# Altium schematic sheet Power_Sources.SchDoc
size A4
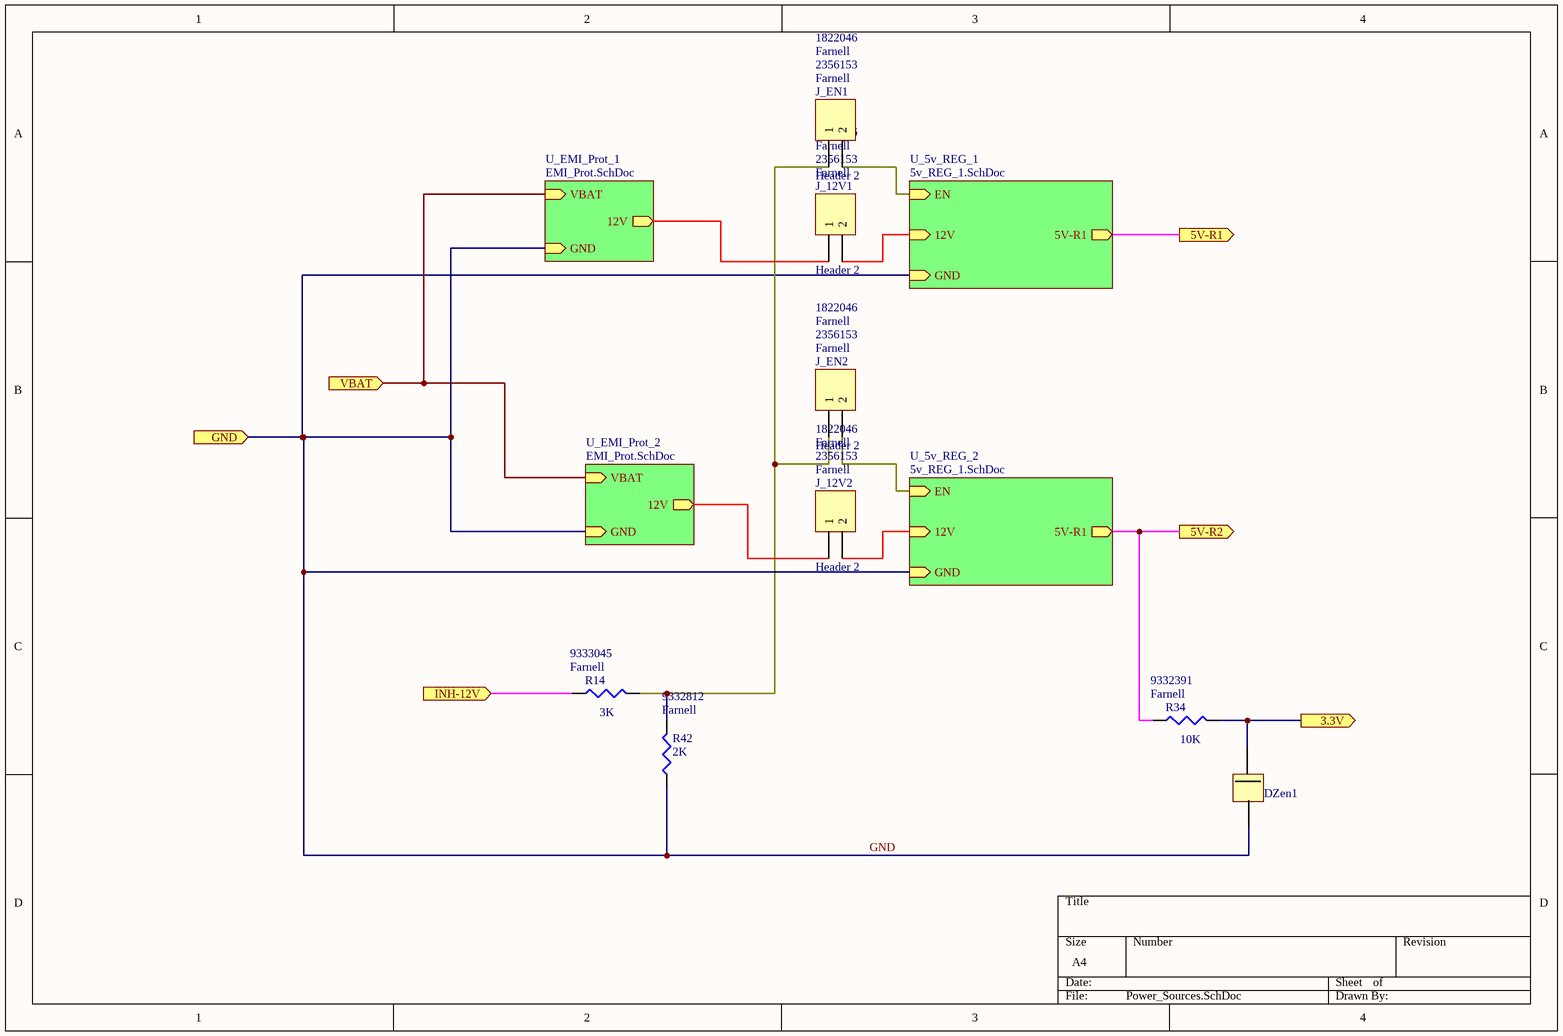
[diagram p0: Power_Sources.SchDoc]

## Parts
DZen1  3.3V  [Zener_Diode]  (value not drawn)
J_12V1  Header 2  Supplier 1: Farnell  Supplier Part Number 1: 2356153  Supplier Part Number 2: 1822046  [HDR1X2]
J_12V2  Header 2  Supplier 1: Farnell  Supplier Part Number 1: 2356153  Supplier Part Number 2: 1822046  [HDR1X2]
J_EN1  Header 2  Supplier 1: Farnell  Supplier Part Number 1: 2356153  Supplier Part Number 2: 1822046  [HDR1X2]
J_EN2  Header 2  Supplier 1: Farnell  Supplier Part Number 1: 2356153  Supplier Part Number 2: 1822046  [HDR1X2]
R14  Supplier 1: Farnell  Supplier Part Number 1: 9333045  [RES_0805]  (hidden comment: 3K)
R34  Supplier 1: Farnell  Supplier Part Number 1: 9332391  [RES_0805]  (hidden comment: 10K)
R42  Supplier 1: Farnell  Supplier Part Number 1: 9332812  [RES_0805]  (hidden comment: 2K)

## Sub-sheets
U_5v_REG_1 = 5v_REG_1.SchDoc: 12V (in), GND (in), EN (in), 5V-R1 (out)
U_5v_REG_2 = 5v_REG_1.SchDoc: 12V (in), GND (in), EN (in), 5V-R1 (out)
U_EMI_Prot_1 = EMI_Prot.SchDoc: VBAT (in), GND (in), 12V (out)
U_EMI_Prot_2 = EMI_Prot.SchDoc: VBAT (in), GND (in), 12V (out)

## Ports
3.3V (out), 5V-R1 (out), 5V-R2 (out), GND (in), INH-12V (in), VBAT (in)

## Nets
3.3V: DZen1.D1 R34.2 ; port 3.3V
5V-R1: port 5V-R1, sheet U_5v_REG_1/5V-R1
5V-R2: R34.1 ; port 5V-R2, sheet U_5v_REG_2/5V-R1
GND: DZen1.D2 R42.1 ; port GND, sheet U_5v_REG_1/GND, sheet U_5v_REG_2/GND, sheet U_EMI_Prot_1/GND, sheet U_EMI_Prot_2/GND
INH-12V: R14.1 ; port INH-12V
VBAT: port VBAT, sheet U_EMI_Prot_1/VBAT, sheet U_EMI_Prot_2/VBAT
NetJ_12V1_1: J_12V1.1 ; sheet U_EMI_Prot_1/12V
NetJ_12V1_2: J_12V1.2 ; sheet U_5v_REG_1/12V
NetJ_12V2_1: J_12V2.1 ; sheet U_EMI_Prot_2/12V
NetJ_12V2_2: J_12V2.2 ; sheet U_5v_REG_2/12V
NetJ_EN1_1: J_EN1.1 J_EN2.1 R14.2 R42.2
NetJ_EN1_2: J_EN1.2 ; sheet U_5v_REG_1/EN
NetJ_EN2_2: J_EN2.2 ; sheet U_5v_REG_2/EN

## Library data of the parts
DZen1 = D_Zener: Zener Diode 3.3V; Supplier Part Number 1: 621-BZT52HC3V3WF-7; Supplier 1: Mouser; HelpURL: http://www.mouser.com/ds/2/115/BZT52HC2V4WF%20-%20BZT52HC47WF-948206.pdf
J_12V1 J_12V2 J_EN1 J_EN2 = Header 2: Header, 2-Pin; LatestRevisionDate: 17-Jul-2002; LatestRevisionNote: Re-released for DXP Platform.; Publisher: Altium Limited; Supplier 2: Farnell
R14 R34 R42 = Res3: Resistor; Published: 8-Jun-2000; LatestRevisionDate: 29-May-2009; LatestRevisionNote: IPC-7351 Footprint Added.; PackageReference: J1-0603; Publisher: Altium Limited; PackageDescription: Chip Resistor
  R14: Value: 3K
  R34: Value: 10K
  R42: Value: 2K